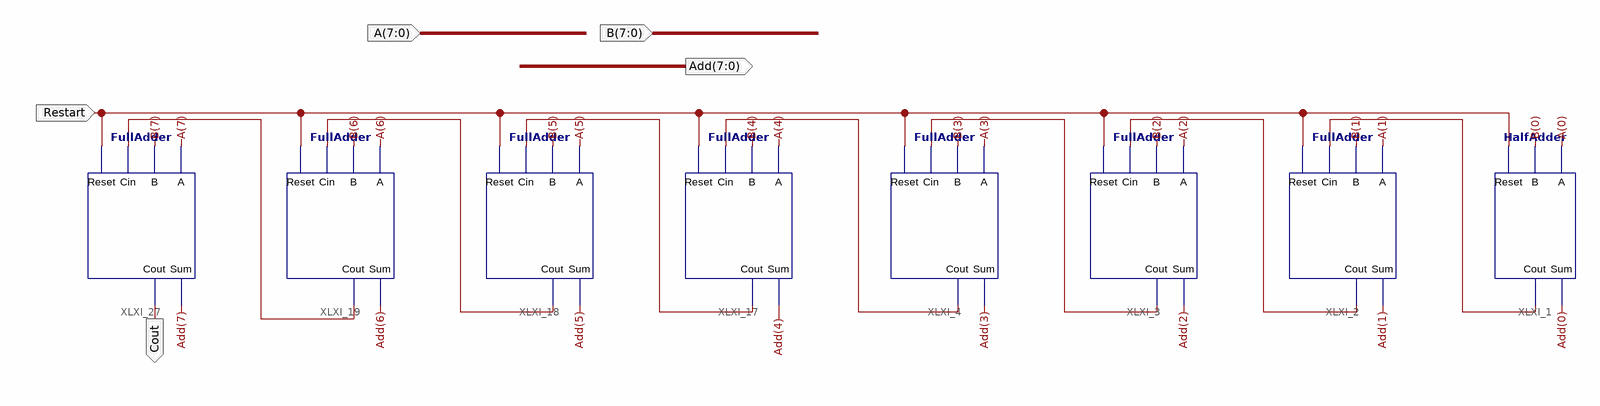
[diagram p0: schematic sheet 1]
// Xilinx ISE schematic EightBitAdder.sch (artix7) as structural Verilog: 8 symbols, 5 ports
module EightBitAdder (
  input  [7:0] A,
  input  [7:0] B,
  input  Restart,
  output [7:0] Add,
  output Cout
);

  wire XLXN_4, XLXN_5, XLXN_6, XLXN_107, XLXN_111, XLXN_116, XLXN_118;

  HalfAdder XLXI_1 (.A(A[0]), .B(B[0]), .Cout(XLXN_4), .Reset(Restart), .Sum(Add[0]));
  FullAdder XLXI_2 (.A(A[1]), .B(B[1]), .Cin(XLXN_4), .Cout(XLXN_5), .Reset(Restart), .Sum(Add[1]));
  FullAdder XLXI_3 (.A(A[2]), .B(B[2]), .Cin(XLXN_5), .Cout(XLXN_6), .Reset(Restart), .Sum(Add[2]));
  FullAdder XLXI_4 (.A(A[3]), .B(B[3]), .Cin(XLXN_6), .Cout(XLXN_107), .Reset(Restart), .Sum(Add[3]));
  FullAdder XLXI_27 (.A(A[7]), .B(B[7]), .Cin(XLXN_118), .Cout(Cout), .Reset(Restart), .Sum(Add[7]));
  FullAdder XLXI_19 (.A(A[6]), .B(B[6]), .Cin(XLXN_116), .Cout(XLXN_118), .Reset(Restart), .Sum(Add[6]));
  FullAdder XLXI_18 (.A(A[5]), .B(B[5]), .Cin(XLXN_111), .Cout(XLXN_116), .Reset(Restart), .Sum(Add[5]));
  FullAdder XLXI_17 (.A(A[4]), .B(B[4]), .Cin(XLXN_107), .Cout(XLXN_111), .Reset(Restart), .Sum(Add[4]));
endmodule
